# EAGLE schematic protoBoard (EAGLE 9.2.2)
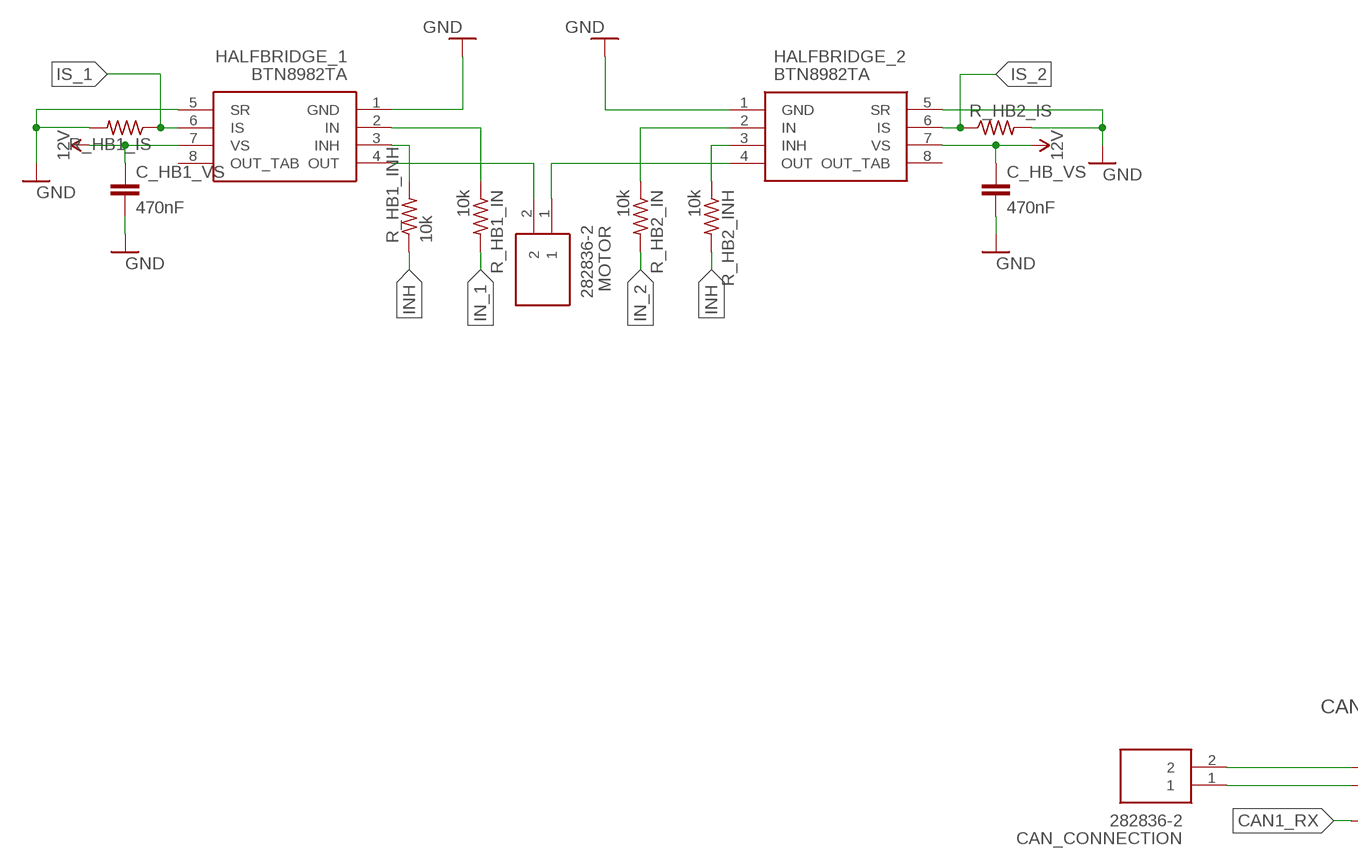
[diagram p0: schematic, sheet 1, part 1 of 2]
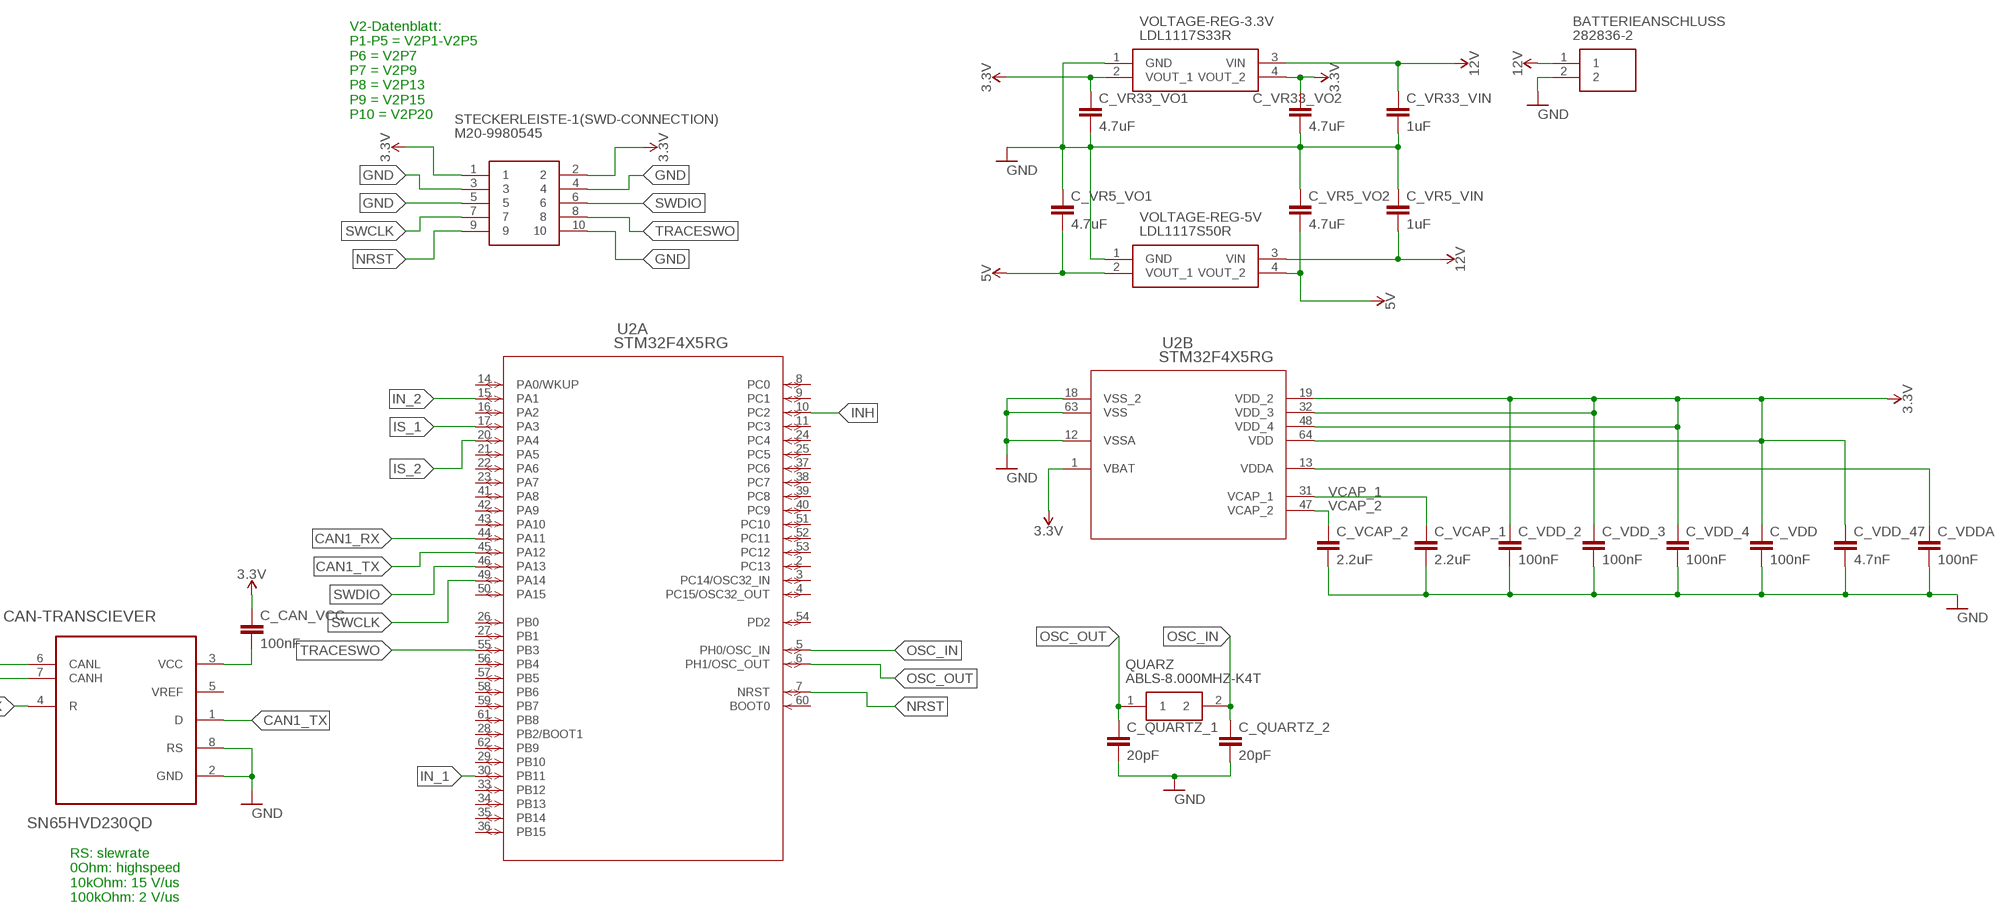
[diagram p1: schematic, sheet 1, part 2 of 2]

## Parts
BATTERIEANSCHLUSS  282836-2  [SHDR2W100P0X500_1X2_1000X820X1]
C_CAN_VCC  100nF  C2.5/6  [C2.5-6]
C_HB1_VS  470nF  C2.5/6  [C2.5-6]
C_HB_VS  470nF  C2.5/6  [C2.5-6]
C_QUARTZ_1  20pF  C2.5/6  [C2.5-6]
C_QUARTZ_2  20pF  C2.5/6  [C2.5-6]
C_VCAP_1  2.2uF  C2.5/6  [C2.5-6]
C_VCAP_2  2.2uF  C2.5/6  [C2.5-6]
C_VDD  100nF  C2.5/6  [C2.5-6]
C_VDD_2  100nF  C2.5/6  [C2.5-6]
C_VDD_3  100nF  C2.5/6  [C2.5-6]
C_VDD_4  100nF  C2.5/6  [C2.5-6]
C_VDD_47  4.7nF  C2.5/6  [C2.5-6]
C_VDDA  100nF  C2.5/6  [C2.5-6]
C_VR5_VIN  1uF  C2.5/6  [C2.5-6]
C_VR5_VO1  4.7uF  C2.5/6  [C2.5-6]
C_VR5_VO2  4.7uF  C2.5/6  [C2.5-6]
C_VR33_VIN  1uF  C2.5/6  [C2.5-6]
C_VR33_VO1  4.7uF  C2.5/6  [C2.5-6]
C_VR33_VO2  4.7uF  C2.5/6  [C2.5-6]
CAN-TRANSCIEVER  SN65HVD230QD  [SOIC127P600X175-8N]
CAN_CONNECTION  282836-2  [SHDR2W100P0X500_1X2_1000X820X1]
HALFBRIDGE_1  BTN8982TA  [TO127P1500X440-8N]
HALFBRIDGE_2  BTN8982TA  [TO127P1500X440-8N]
MOTOR  282836-2  [SHDR2W100P0X500_1X2_1000X820X1]
QUARZ  ABLS-8.000MHZ-K4T  [ABLS-12.000MHZ-B2]
R_HB1_IN  10k  R-US_0204/7  [0204/7]
R_HB1_INH  10k  R-US_0204/7  [0204/7]
R_HB1_IS  R-US_0204/7  [0204/7]
R_HB2_IN  10k  R-US_0204/7  [0204/7]
R_HB2_INH  10k  R-US_0204/7  [0204/7]
R_HB2_IS  R-US_0204/7  [0204/7]
STECKERLEISTE-1(SWD-CONNECTION)  M20-9980545  [HDRV10W80P254_2X5_1270X508X864]
U2  STM32F4X5RG  [LQFP64-10X10MM]
VOLTAGE-REG-3.3V  LDL1117S33R  [SOT230P700X180-4N]
VOLTAGE-REG-5V  LDL1117S50R  [SOT230P700X180-4N]

## Nets
12V: BATTERIEANSCHLUSS.1 C_HB1_VS.1 C_HB_VS.1 C_VR5_VIN.2 C_VR33_VIN.1 HALFBRIDGE_1.7(VS) HALFBRIDGE_2.7(VS) VOLTAGE-REG-3.3V.3(VIN) VOLTAGE-REG-5V.3(VIN)
CAN1_RX: CAN-TRANSCIEVER.4(R) U2.44(A:PA11)
CAN1_TX: CAN-TRANSCIEVER.1(D) U2.45(A:PA12)
GND: BATTERIEANSCHLUSS.2 C_HB1_VS.2 C_HB_VS.2 C_QUARTZ_1.2 C_QUARTZ_2.2 C_VCAP_1.2 C_VCAP_2.2 C_VDD.2 C_VDD_2.2 C_VDD_3.2 C_VDD_4.2 C_VDD_47.2 C_VDDA.2 C_VR5_VIN.1 C_VR5_VO1.1 C_VR5_VO2.1 C_VR33_VIN.2 C_VR33_VO1.2 C_VR33_VO2.2 CAN-TRANSCIEVER.2(GND) CAN-TRANSCIEVER.8(RS) HALFBRIDGE_1.1(GND) HALFBRIDGE_1.5(SR) HALFBRIDGE_2.1(GND) HALFBRIDGE_2.5(SR) R_HB1_IS.2 R_HB2_IS.2 STECKERLEISTE-1(SWD-CONNECTION).3 STECKERLEISTE-1(SWD-CONNECTION).4 STECKERLEISTE-1(SWD-CONNECTION).5 STECKERLEISTE-1(SWD-CONNECTION).10 U2.12(B:VSSA) U2.18(B:VSS_2) U2.63(B:VSS) VOLTAGE-REG-3.3V.1(GND) VOLTAGE-REG-5V.1(GND)
IN_1: R_HB1_IN.2 U2.30(A:PB11)
IN_2: R_HB2_IN.2 U2.15(A:PA1)
INH: R_HB1_INH.1 R_HB2_INH.2 U2.10(A:PC2)
IS_1: HALFBRIDGE_1.6(IS) R_HB1_IS.1 U2.17(A:PA3)
IS_2: HALFBRIDGE_2.6(IS) R_HB2_IS.1 U2.20(A:PA4)
N$1: C_VDDA.1 U2.13(B:VDDA)
N$4: C_CAN_VCC.2 CAN-TRANSCIEVER.3(VCC)
N$5: CAN-TRANSCIEVER.6(CANL) CAN_CONNECTION.2
N$6: CAN-TRANSCIEVER.7(CANH) CAN_CONNECTION.1
N$7: HALFBRIDGE_1.4(OUT) MOTOR.2
N$8: HALFBRIDGE_2.4(OUT) MOTOR.1
N$9: HALFBRIDGE_1.3(INH) R_HB1_INH.2
N$10: HALFBRIDGE_2.3(INH) R_HB2_INH.1
N$11: HALFBRIDGE_1.2(IN) R_HB1_IN.1
N$12: HALFBRIDGE_2.2(IN) R_HB2_IN.1
NRST: STECKERLEISTE-1(SWD-CONNECTION).9 U2.7(A:NRST)
OSC_IN: C_QUARTZ_2.1 QUARZ.2 U2.5(A:PH0/OSC_IN)
OSC_OUT: C_QUARTZ_1.1 QUARZ.1 U2.6(A:PH1/OSC_OUT)
SWCLK: STECKERLEISTE-1(SWD-CONNECTION).7 U2.49(A:PA14)
SWDIO: STECKERLEISTE-1(SWD-CONNECTION).6 U2.46(A:PA13)
TRACESWO: STECKERLEISTE-1(SWD-CONNECTION).8 U2.55(A:PB3)
VCAP_1: C_VCAP_1.1 U2.31(B:VCAP_1)
VCAP_2: C_VCAP_2.1 U2.47(B:VCAP_2)
VCC: C_CAN_VCC.1 C_VDD.1 C_VDD_2.1 C_VDD_3.1 C_VDD_4.1 C_VDD_47.1 C_VR5_VO1.2 C_VR5_VO2.2 C_VR33_VO1.1 C_VR33_VO2.1 STECKERLEISTE-1(SWD-CONNECTION).1 STECKERLEISTE-1(SWD-CONNECTION).2 U2.1(B:VBAT) U2.19(B:VDD_2) U2.32(B:VDD_3) U2.48(B:VDD_4) U2.64(B:VDD) VOLTAGE-REG-3.3V.2(VOUT_1) VOLTAGE-REG-3.3V.4(VOUT_2) VOLTAGE-REG-5V.2(VOUT_1) VOLTAGE-REG-5V.4(VOUT_2) ; supply symbol labelled 3.3V, 5V
Unconnected: CAN-TRANSCIEVER.5(VREF) HALFBRIDGE_1.8(OUT_TAB) HALFBRIDGE_2.8(OUT_TAB) U2.2(A:PC13) U2.3(A:PC14/OSC32_IN) U2.4(A:PC15/OSC32_OUT) U2.8(A:PC0) U2.9(A:PC1) U2.11(A:PC3) U2.14(A:PA0/WKUP) U2.16(A:PA2) U2.21(A:PA5) U2.22(A:PA6) U2.23(A:PA7) U2.24(A:PC4) U2.25(A:PC5) U2.26(A:PB0) U2.27(A:PB1) U2.28(A:PB2/BOOT1) U2.29(A:PB10) U2.33(A:PB12) U2.34(A:PB13) U2.35(A:PB14) U2.36(A:PB15) U2.37(A:PC6) U2.38(A:PC7) U2.39(A:PC8) U2.40(A:PC9) U2.41(A:PA8) U2.42(A:PA9) U2.43(A:PA10) U2.50(A:PA15) U2.51(A:PC10) U2.52(A:PC11) U2.53(A:PC12) U2.54(A:PD2) U2.56(A:PB4) U2.57(A:PB5) U2.58(A:PB6) U2.59(A:PB7) U2.60(A:BOOT0) U2.61(A:PB8) U2.62(A:PB9)

## Notes on the sheet
- V2-Datenblatt:
  P1-P5 = V2P1-V2P5
  P6 = V2P7
  P7 = V2P9
  P8 = V2P13
  P9 = V2P15
  P10 = V2P20
- RS: slewrate
  0Ohm: highspeed
  10kOhm: 15 V/us
  100kOhm: 2 V/us

## Library data of the parts
BATTERIEANSCHLUSS CAN_CONNECTION MOTOR = SamacSys_Parts:282836-2: TERMINAL BLOCK, PCB MOUNT, SIDE WIRE ENTRY, STACKING , 5.00mm PITCH Source: Datasheet <http://www.mouser.com/datasheet/2/418/NG_CD_282836_H10-1248046.pdf>; DESCRIPTION: TERMINAL BLOCK, PCB MOUNT, SIDE WIRE ENTRY, STACKING , 5.00mm PITCH; HEIGHT: 10.2mm; MANUFACTURER_NAME: TE Connectivity; MANUFACTURER_PART_NUMBER: 282836-2; MOUSER_PART_NUMBER: 571-2828362
C_CAN_VCC C_HB1_VS C_HB_VS C_QUARTZ_1 C_QUARTZ_2 C_VCAP_1 C_VCAP_2 C_VDD C_VDD_2-C_VDD_4 C_VDD_47 C_VDDA C_VR5_VIN C_VR5_VO1 C_VR5_VO2 C_VR33_VIN C_VR33_VO1 C_VR33_VO2 = capacitor-wima:C: CAPACITOR naming: grid - package width; OC_FARNELL: unknown
CAN-TRANSCIEVER = ADP_Components:SN65HVD230QD: 3.3-V CAN TRANSCEIVERS; MF: TEXAS INSTRUMENTS; MPN: SN65HVD230QD..; OC_FARNELL: 1648752; OC_NEWARK: 75C7746; PACKAGE: SOIC-8; SUPPLIER: Texas Instruments
HALFBRIDGE_1 HALFBRIDGE_2 = SamacSys_Parts:BTN8982TA: New Infineon BTN8982TA Motor Driver,, 7-Pin TO-263-7-1 Source: Datasheet <http://www.mouser.com/datasheet/2/196/Infineon-BTN8982TA-DS-v01_00-EN-786008.pdf>; DESCRIPTION: New Infineon BTN8982TA Motor Driver,, 7-Pin TO-263-7-1; HEIGHT: 4.4mm; MANUFACTURER_NAME: Infineon; MANUFACTURER_PART_NUMBER: BTN8982TA; MOUSER_PART_NUMBER: 726-BTN8982TA
QUARZ = SamacSys_Parts:ABLS-8.000MHZ-K4T: ABRACON - ABLS-8.000MHZ-K4T - CRYSTAL, 8MHZ, 18PF, HC-49US Source: Datasheet <https://componentsearchengine.com/Datasheets/1/ABLS-8.000MHZ-K4T.pdf>; DESCRIPTION: ABRACON - ABLS-8.000MHZ-K4T - CRYSTAL, 8MHZ, 18PF, HC-49US; HEIGHT: mm; MANUFACTURER_NAME: ABRACON; MANUFACTURER_PART_NUMBER: ABLS-8.000MHZ-K4T; MF: ABRACON; MOUSER_PART_NUMBER: 815-ABLS-8.0MK4-T; MPN: ABLS-8.000MHZ-K4T; OC_FARNELL: 2467758
R_HB1_IN R_HB1_INH R_HB1_IS R_HB2_IN R_HB2_INH R_HB2_IS = adafruit:R-US_: RESISTOR, American symbol
STECKERLEISTE-1(SWD-CONNECTION) = SamacSys_Parts:M20-9980545: M20 Header, Pin, Dil, Vertical, 5+5 W HARWIN M20 Series, 2.54mm Pitch 10 Way 2 Row Straight Pin Header, Through Hole, Solder Termination Source: Datasheet <http://www.mouser.com/datasheet/2/181/M20-998-1220570.pdf>; DESCRIPTION: M20 Header, Pin, Dil, Vertical, 5+5 W HARWIN M20 Series, 2.54mm Pitch 10 Way 2 Row Straight Pin Header, Through Hole, Solder Termination; HEIGHT: 8.64mm; MANUFACTURER_NAME: HARWIN; MANUFACTURER_PART_NUMBER: M20-9980545; MF: HARWIN; MOUSER_PART_NUMBER: 855-M20-9980545; MPN: M20-9980545; OC_FARNELL: 1022235
U2 = ADP_Components:STM32F4X5RG; MANUFACTURER_PART_NUMBER: STM32F4X5RG; OC_FARNELL: unknown; VENDOR: STMicroelectronics
VOLTAGE-REG-3.3V = SamacSys_Parts:LDL1117S33R: STMICROELECTRONICS - LDL1117S33R - LDO, FIXED, 3.3V, 1.2A, SOT-223-3 Source: Datasheet <http://www.mouser.com/datasheet/2/389/ldl1117-1156241.pdf>; DESCRIPTION: STMICROELECTRONICS - LDL1117S33R - LDO, FIXED, 3.3V, 1.2A, SOT-223-3; HEIGHT: 1.8mm; MANUFACTURER_NAME: STMicroelectronics; MANUFACTURER_PART_NUMBER: LDL1117S33R; MF: STMICROELECTRONICS; MOUSER_PART_NUMBER: 511-LDL1117S33R; MPN: LDL1117S33R; OC_FARNELL: 2729708
VOLTAGE-REG-5V = SamacSys_Parts:LDL1117S50R: STMICROELECTRONICS - LDL1117S50R - LDO, FIXED, 5V, 1.2A, SOT-223-3 Source: Datasheet <http://www.mouser.com/datasheet/2/389/ldl1117-1156241.pdf>; DESCRIPTION: STMICROELECTRONICS - LDL1117S50R - LDO, FIXED, 5V, 1.2A, SOT-223-3; HEIGHT: 1.8mm; MANUFACTURER_NAME: STMicroelectronics; MANUFACTURER_PART_NUMBER: LDL1117S50R; MF: STMICROELECTRONICS; MOUSER_PART_NUMBER: 511-LDL1117S50R; MPN: LDL1117S50R; OC_FARNELL: 2729709